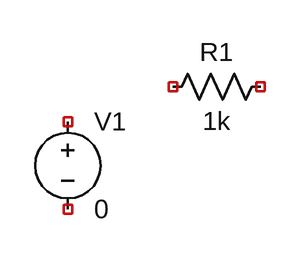
[diagram p0: schematic Draft3.asc]
Draft3.asc, the LTspice schematic file:
Version 4.1
SHEET 1 880 680
SYMBOL voltage 112 112 R0
SYMATTR InstName V1
SYMATTR Value 0
SYMBOL res 304 80 R90
WINDOW 0 0 56 VBottom 2
WINDOW 3 32 56 VTop 2
SYMATTR InstName R1
SYMATTR Value 1k

The netlist it stands for:
* Draft3.asc
V1 NC_01 NC_02 0
R1 NC_03 NC_04 1k
.backanno
.end